# Altium project Remie_Morse.PrjPcb (part 2 of 3)
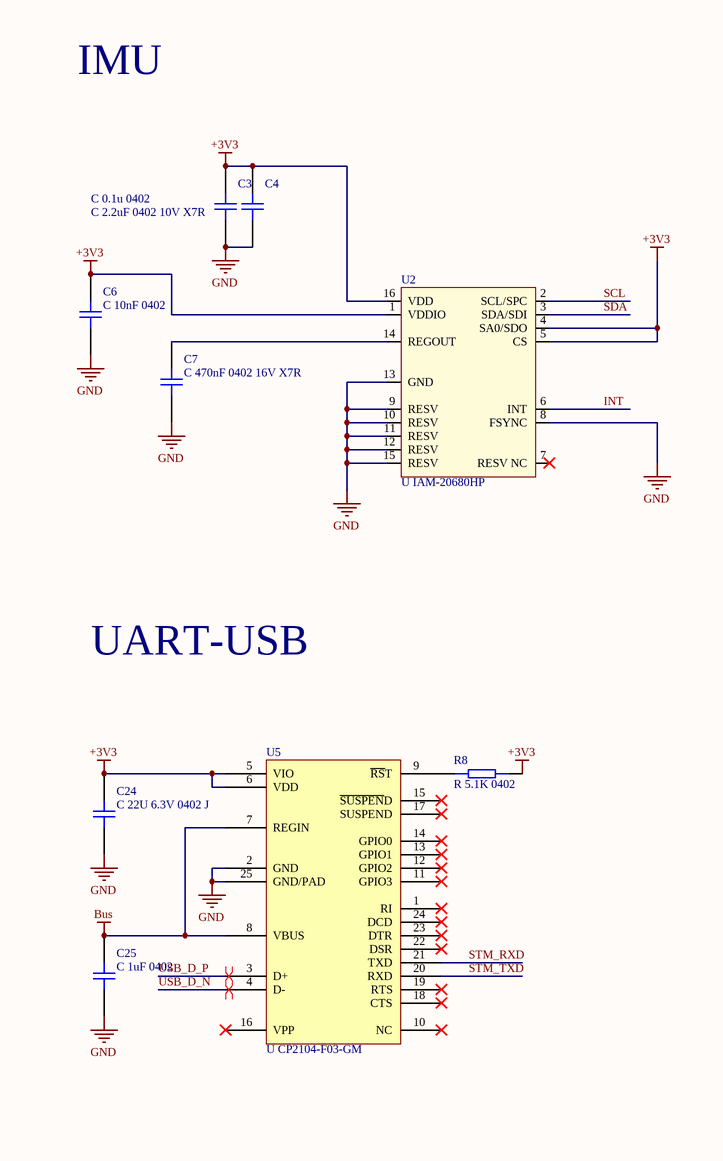
[diagram p2: Remie_Schematic.SchDoc, right]

## Sheet Remie_Schematic.SchDoc (continued)
### Library data of the parts
ANT1 = ANT AMCA31-2R450G-S1F-T3: Chip Dielectric Antenna; 1dBi; 2450MHz; T/R | Abracon AMCA31-2R450G-S1F-T3; Supplier: Mouser; Supplier Part Number: 815-CA312R450GS1FT3; Manufacturer: Abracon; Manufacturer Part Number: AMCA31-2R450G-S1F-T3; RoHS: Yes; Category: RF Antennas; Stock: 21374; Pricing: 1=0,43, 10=0,321, 50=0,321, 100=0,229, 1000=0,148, 10000=0,148 (USD); ComponentLink1URL: https://datasheet.ciiva.com/29647/amca31-2r450g-s1f-t-29647350.pdf?src-supplier=Digikey; ComponentLink1Description: https://datasheet.ciiva.com/29647/amca31-2r450g-s1f-t-29647350.pdf?src-supplier=Digikey
C1 C5 = C 1U 0805 X7R 16V: Multilayer Ceramic Capacitor, 1 uF, 16 V, ± 10%, X7R, 0805 [2012 Metric]; Manufacturer: KEMET; Manufacturer Part Number: C0805C105K4RACTU; Dissipation Factor: 5%; Material: 4241ConductorMaterial; Supplier 1: RSComponents; RoHS: Yes; Category: Ceramic Capacitors; Stock 1: 10300; Pricing 1: 25=0,06100 (USD); Mount: Surface Mount,PCB; Case/Package: 0805; Number of Pins: 2; Dielectric Material: Ceramic; Case Code (Metric): 2012; Case Code (Imperial): 0805; Contact Plating: Tin,Matte; Min Operating Temperature: -55°C; Max Operating Temperature: 125°C; Capacitance: 1uF; Tolerance: 10%; Packaging: Tape and Reel; Voltage Rating (DC): 16V; Dielectric: X7R; Package Quantity: 1; Voltage Rating: 16V; Termination: SMD/SMT; Voltage: 16V; Series: C; Construction: Flat; Length: 2mm; Width: 0.049inch; Height: 0.9mm; Thickness: 0.039inch; Lead Pitch: 0.75mm; Depth: 1.25mm; Radiation Hardening: No; REACH SVHC: No SVHC; RoHS Compliant: Yes; ComponentLink1URL: https://datasheet.ciiva.com/6074/1722731-6074364.pdf?src-supplier=Farnell; ComponentLink1Description: https://datasheet.ciiva.com/6074/1722731-6074364.pdf?src-supplier=Farnell; ComponentLink2URL: https://datasheet.ciiva.com/28692/1851736-28692942.pdf?src-supplier=Element14; ComponentLink2Description: https://datasheet.ciiva.com/28692/1851736-28692942.pdf?src-supplier=Element14; ComponentLink3URL: https://datasheet.ciiva.com/14585/70095383-14585511.pdf?src-supplier=Allied+Electronics; ComponentLink3Description: https://datasheet.ciiva.com/14585/70095383-14585511.pdf?src-supplier=Allied+Electronics; ComponentLink4URL: https://datasheet.ciiva.com/14603/70095383-14603388.pdf?src-supplier=Allied+Electronics; ComponentLink4Description: https://datasheet.ciiva.com/14603/70095383-14603388.pdf?src-supplier=Allied+Electronics; ComponentLink5URL: https://datasheet.ciiva.com/45846/docfinderpartnumberc0402c102k5ractu-45846934.pdf?src-supplier=Onlinecomponents.com; ComponentLink5Description: https://datasheet.ciiva.com/45846/docfinderpartnumberc0402c102k5ractu-45846934.pdf?src-supplier=Onlinecomponents.com; ComponentLink6URL: https://datasheet.ciiva.com/18193/getdatasheetpartid-331279-18193467.pdf?src-supplier=Verical; ComponentLink6Description: https://datasheet.ciiva.com/18193/getdatasheetpartid-331279-18193467.pdf?src-supplier=Verical; ComponentLink7URL: https://datasheet.ciiva.com/39122/docfinderpartnumberc0402c102k5ractu-39122926.pdf?src-supplier=Onlinecomponents.com; ComponentLink7Description: https://datasheet.ciiva.com/39122/docfinderpartnumberc0402c102k5ractu-39122926.pdf?src-supplier=Onlinecomponents.com; Supplier Part Number 1: 4515770; Supplier: Mouser; Supplier Part Number: 80-C0805C105K4R; Stock: 415305; Pricing: 1=0,1, 10=0,07, 50=0,07, 100=0,041, 1000=0,026, 10000=0,019 (USD); Mounting Technology: Surface Mount,PCB; Pins: 2; Value: 1uF; Voltage Rating (AC): 16V; Reach SVHC Compliant: No; Lead Free: 5697LeadFree
C2 = C 10uF 1206 6.3V X7R: 1206 6.3 V 10 uF ±10% Tolerance X7R SMT Multilayer Ceramic Capacitor; Manufacturer: Kyocera AVX; Capacitance: 10uF; Voltage Rating: 6.3V; Supplier 1: Mouser; Manufacturer Part Number: 12066C106KAT2A; RoHS: Yes; Category: Ceramic Capacitors; Stock 1: 4630; Pricing 1: 1=0,45000, 10=0,42000, 50=0,42000, 100=0,42000, 1000=0,42000, 10000=0,35600 (USD); Mount: Surface Mount; Case/Package: 1206; Number of Pins: 2; Case Code (Metric): 3216; Case Code (Imperial): 1206; Min Operating Temperature: -55°C; Max Operating Temperature: 125°C; Tolerance: 10%; Packaging: Tape and Reel; Dielectric: X7R; Package Quantity: 2500; Voltage Rating (DC): 6.3V; Termination: SMD/SMT; Length: 3.2mm; Width: 0.063inch; Height: 1.78mm; Thickness: 0.037inch; Depth: 1.6mm; Radiation Hardening: No; Lead Free: Lead Free; ComponentLink1URL: https://datasheet.ciiva.com/6265/cx7r-6265898.pdf?src-supplier=Digi-Key; ComponentLink1Description: https://datasheet.ciiva.com/6265/cx7r-6265898.pdf?src-supplier=Digi-Key; ComponentLink2URL: https://datasheet.ciiva.com/5427/cx7r-218113-5427819.pdf?src-supplier=Mouser; ComponentLink2Description: https://datasheet.ciiva.com/5427/cx7r-218113-5427819.pdf?src-supplier=Mouser; Supplier Part Number 1: 581-12066C106KAT2A; Supplier: Digikey; Supplier Part Number: 478-KGM31HR70J106KUCT-ND; Stock: 43567; Pricing: 1=1,1, 10=0,822, 50=0,7498, 100=0,6143, 500=0,49028, 1000=0,4326 (USD); ComponentLink3URL: https://datasheet.ciiva.com/6265/cx7r-6265898.pdf?src-supplier=Digikey; ComponentLink3Description: https://datasheet.ciiva.com/6265/cx7r-6265898.pdf?src-supplier=Digikey
C3 C15-C18 = C 0.1u 0402: Multilayer Ceramic Capacitor, 0.1 uF, 50 V, ± 10%, X7R, 0402 [1005 Metric]; Manufacturer: Samsung; Manufacturer Part Number: CL05B104KB54PNC; Material: 4241ConductorMaterial; Voltage Rating: 50V; Value: 100nF; Supplier 1: Digi-Key; RoHS: Yes; Category: Ceramic Capacitors; Stock 1: 3863336; Pricing 1: 1=0,10000, 10=0,04600, 50=0,02500, 100=0,02040, 500=0,01460, 1000=0,01147, 2500=0,01043, 5000=0,00959 (USD); RoHS Compliant: Yes; Supplier Part Number 1: 1276-CL05B104KB54PNCCT-ND; JLCPCB: C307331; Supplier: Digikey; Supplier Part Number: 1276-CL05B104KB54PNCCT-ND; Stock: 765476; Pricing: 1=0,1, 10=0,044, 50=0,025, 100=0,0194, 500=0,0146, 1000=0,01147, 2500=0,01043, 5000=0,00959 (USD); Case/Package: 343Case; Min Operating Temperature: -55°C; Max Operating Temperature: 125°C; Tolerance: 10%; Height: 550um; ComponentLink1URL: https://datasheet.octopart.com/CL05B104KB54PNC-Samsung-datasheet-8326407.pdf?src-supplier=TME; ComponentLink1Description: https://datasheet.octopart.com/CL05B104KB54PNC-Samsung-datasheet-8326407.pdf?src-supplier=TME
C4 = C 2.2uF 0402 10V X7R: Multilayer Ceramic Capacitor, 2.2 uF, 10 V, ± 10%, X7R, 0402 [1005 Metric] CC0402KRX5R7BB225; Manufacturer: Yageo; Material: 4241ConductorMaterial; Voltage Rating: 16V; Dielectric: X5R; Temperature Coefficient: 30ppm/°C; Supplier: Mouser; Supplier Part Number: 603-CC402KRX5R7BB225; Manufacturer Part Number: CC0402KRX5R7BB225; RoHS: Yes; Category: Ceramic Capacitors; Stock: 83882; Pricing: 1=0,17, 10=0,067, 50=0,067, 100=0,039, 1000=0,03, 10000=0,023 (USD); Mounting Technology: Surface Mount; Case/Package: 0402; Case Code (Metric): 1005; Case Code (Imperial): 0402; Weight: 2.3E-05oz; Min Operating Temperature: -55°C; Max Operating Temperature: 85°C; Packaging: Tape and Reel; Value: 2.2uF; Tolerance: 10%; Package Quantity: 5000; Series: CC; Termination: SMD/SMT; Voltage Rating (DC): 16V; Length: 1mm; Width: 0.5mm; Height: 0.5mm; RoHS Compliant: Yes; Lead Free: Lead Free; Halogen Free: Halogen Free; ComponentLink1URL: http://www.mouser.com/ds/2/447/Yageo_UPY-GP_NP0_16V-to-50V_9-358835.pdf?src-supplier=Mouser; ComponentLink1Description: http://www.mouser.com/ds/2/447/Yageo_UPY-GP_NP0_16V-to-50V_9-358835.pdf?src-supplier=Mouser; ComponentLink2URL: http://www.yageo.com/documents/recent/UPY-GPHC_X5R_4V-to-50V_25.pdf?src-supplier=Digikey; ComponentLink2Description: http://www.yageo.com/documents/recent/UPY-GPHC_X5R_4V-to-50V_25.pdf?src-supplier=Digikey; ComponentLink3URL: https://www.yageo.com/upload/media/product/productsearch/datasheet/mlcc/UPY-GPHC_X5R_4V-to-50V_25.pdf?src-supplier=Digikey; ComponentLink3Description: https://www.yageo.com/upload/media/product/productsearch/datasheet/mlcc/UPY-GPHC_X5R_4V-to-50V_25.pdf?src-supplier=Digikey; ComponentLink4URL: https://datasheet.octopart.com/CC0402KRX5R7BB225-Yageo-datasheet-158238148.pdf?src-supplier=Farnell; ComponentLink4Description: https://datasheet.octopart.com/CC0402KRX5R7BB225-Yageo-datasheet-158238148.pdf?src-supplier=Farnell; ComponentLink5URL: https://datasheet.octopart.com/CC0402KRX5R7BB225-Yageo-datasheet-158238148.pdf?src-supplier=Newark; ComponentLink5Description: https://datasheet.octopart.com/CC0402KRX5R7BB225-Yageo-datasheet-158238148.pdf?src-supplier=Newark; ComponentLink6URL: https://datasheet.octopart.com/CC0402KRX5R7BB225-Yageo-datasheet-137700082.pdf?src-supplier=Future+Electronics; ComponentLink6Description: https://datasheet.octopart.com/CC0402KRX5R7BB225-Yageo-datasheet-137700082.pdf?src-supplier=Future+Electronics
C6 C20 = C 10nF 0402: Multilayer Ceramic Capacitor, 0.01 uF, 50 V, ± 10%, X7R, 0402 [1005 Metric]; Manufacturer: Samsung; Manufacturer Part Number: CL05B103KB5NNNC; Voltage Rating: 50V; Supplier 1: Arrow Electronics; RoHS: Yes; Category: Ceramic Capacitors; Stock 1: 6530000; Pricing 1: 10000=0,00290, 20000=0,00230, 50000=0,00210, 100000=0,00190 (USD); Mount: Surface Mount; Case/Package: 0402; Case Code (Metric): 1005; Case Code (Imperial): 0402; Material: Ceramic; Contact Plating: Tin; Min Operating Temperature: -55°C; Max Operating Temperature: 125°C; Tolerance: 10%; Packaging: Tape and Reel; Capacitance: 10nF; Package Quantity: 1; Dielectric: X7R; Voltage: 50V; Voltage Rating (DC): 50V; Series: CL; Construction: Flat; Length: 1mm; Width: 0.02inch; Height: 0.5mm; Thickness: 0.022inch; Depth: 0.5mm; Radiation Hardening: No; Lead Free: Lead Free; RoHS Compliant: Yes; ComponentLink1URL: https://datasheet.ciiva.com/15195/getdatasheetpartid-359682-15195636.pdf?src-supplier=Verical; ComponentLink1Description: https://datasheet.ciiva.com/15195/getdatasheetpartid-359682-15195636.pdf?src-supplier=Verical; ComponentLink2URL: https://datasheet.ciiva.com/29198/458761-da-01-en-vs-kondensator-0402-29198432.pdf?src-supplier=Conrad; ComponentLink2Description: https://datasheet.ciiva.com/29198/458761-da-01-en-vs-kondensator-0402-29198432.pdf?src-supplier=Conrad; ComponentLink3URL: https://datasheet.ciiva.com/26309/mlcc-catalogdownload2013-eng-26309005.pdf?src-supplier=Distrelec; ComponentLink3Description: https://datasheet.ciiva.com/26309/mlcc-catalogdownload2013-eng-26309005.pdf?src-supplier=Distrelec; Supplier 2: Digi-Key; Stock 2: 14692768; Pricing 2: 1=0,10000, 10=0,01500, 50=0,00820, 100=0,00670, 500=0,00478, 1000=0,00375, 2500=0,00341, 5000=0,00314 (USD); Supplier 3: Mouser; Stock 3: 2909879; Pricing 3: 1=0,10000, 10=0,00900, 50=0,00900, 100=0,00700, 500=0,00600, 1000=0,00500, 2500=0,00400, 10000=0,00300, 20000=0,00200 (USD); Supplier Part Number 1: CL05B103KB5NNNC; Supplier Part Number 2: 1276-1028-1-ND; Supplier Part Number 3: 187-CL05B103KB5NNNC; JLCPCB: C15195; Supplier: Mouser; Supplier Part Number: 187-CL05B103KB5NNNC; Stock: 525397; Pricing: 1=0,1, 10=0,007, 50=0,007, 100=0,005, 1000=0,003, 10000=0,002 (USD); Mounting Technology: Surface Mount; Value: 10nF
C7 = C 470nF 0402 16V X7R: Multilayer Ceramic Capacitor, 0.47 uF, 16 V, ± 10%, X7R, 0402 [1005 Metric] CC0402KRX7R5BB474; Manufacturer: Yageo; Material: 4241ConductorMaterial; Voltage Rating (DC): 6.3V; Dielectric: 1511DielectricType; Temperature Coefficient: 30ppm/°C; Supplier: Digikey; Supplier Part Number: 13-CC0402KRX7R5BB474CT-ND; Manufacturer Part Number: CC0402KRX7R5BB474; Category: Ceramic Capacitors; Stock: 60692; Pricing: 1=0,27, 10=0,178, 50=0,1122, 100=0,0897, 500=0,0648, 1000=0,05733, 2500=0,05484, 5000=0,04985 (USD); Case/Package: 343Case; Min Operating Temperature: -55°C; Max Operating Temperature: 125°C; Value: 470nF; Voltage Rating: 6.3V; Height: 550um; RoHS Compliant: Yes; Lead Free: 5697LeadFree; Halogen Free: 5694HalogenFree; ComponentLink1URL: https://datasheet.octopart.com/CC0402KRX7R5BB474-Yageo-datasheet-78855684.pdf?src-supplier=Upverter; ComponentLink1Description: https://datasheet.octopart.com/CC0402KRX7R5BB474-Yageo-datasheet-78855684.pdf?src-supplier=Upverter; ComponentLink2URL: https://datasheet.octopart.com/CC0402KRX7R5BB474-Yageo-datasheet-166511530.pdf?src-supplier=Future+Electronics; ComponentLink2Description: https://datasheet.octopart.com/CC0402KRX7R5BB474-Yageo-datasheet-166511530.pdf?src-supplier=Future+Electronics; ComponentLink3URL: https://datasheet.octopart.com/CC0402KRX7R5BB474-Yageo-datasheet-165992755.pdf?src-supplier=Future+Electronics; ComponentLink3Description: https://datasheet.octopart.com/CC0402KRX7R5BB474-Yageo-datasheet-165992755.pdf?src-supplier=Future+Electronics; ComponentLink4URL: https://datasheet.octopart.com/CC0402KRX7R5BB474-Yageo-datasheet-10883670.pdf; ComponentLink4Description: https://datasheet.octopart.com/CC0402KRX7R5BB474-Yageo-datasheet-10883670.pdf
C8 C9 = C 22uF 1210 X7R 6.3V: Cap Ceramic 22uF 6.3V X7R 10% SMD 1210 125C Plastic T/R; Manufacturer: KEMET; Supplier 1: Mouser; Manufacturer Part Number: C1210C226K9RACTU; RoHS: Yes; Category: Ceramic Capacitors; Stock 1: 951; Pricing 1: 1=0,88000, 10=0,55700, 50=0,55700, 100=0,48000, 1000=0,36300, 10000=0,36300 (USD); Mount: Surface Mount; Case/Package: 1210; Case Code (Imperial): 1210; Case Code (Metric): 3225; Dielectric Material: Ceramic; Min Operating Temperature: -55°C; Max Operating Temperature: 125°C; Tolerance: 10%; Capacitance: 22uF; Voltage Rating (DC): 6.3V; Packaging: Tape and Reel; Package Quantity: 1000; Dielectric: X7R; Termination: SMD/SMT; Voltage Rating: 6.3V; Series: C; Construction: Flat; Length: 3.2mm; Width: 2.5mm; Height: 2.5mm; Thickness: 0.11inch; Depth: 2.5mm; Radiation Hardening: No; RoHS Compliant: Yes; REACH SVHC: No SVHC; ComponentLink1URL: https://datasheet.ciiva.com/5413/kem-c1002-x7r-smd-357932-5413704.pdf?src-supplier=Mouser; ComponentLink1Description: https://datasheet.ciiva.com/5413/kem-c1002-x7r-smd-357932-5413704.pdf?src-supplier=Mouser; ComponentLink2URL: https://datasheet.ciiva.com/7807/kem-c1002-x7r-smd-7807532.pdf?src-supplier=Element14; ComponentLink2Description: https://datasheet.ciiva.com/7807/kem-c1002-x7r-smd-7807532.pdf?src-supplier=Element14; ComponentLink3URL: https://datasheet.ciiva.com/28608/1918693-28608766.pdf?src-supplier=Element14; ComponentLink3Description: https://datasheet.ciiva.com/28608/1918693-28608766.pdf?src-supplier=Element14; Supplier Part Number 1: 80-C1210C226K9R
C10 = C 0.8 pF 0402 50V C0G: Multilayer Ceramic Capacitor, 0.8 pF, 50 V, ± 0.1pF, C0G (NP0), 0402 [1005 Metric] GRM1555C1HR80BA01D; Manufacturer: Murata; Value: 0.8pF; Supplier: Mouser; Supplier Part Number: 81-GRM1555C1HR80BA1D; Manufacturer Part Number: GRM1555C1HR80BA01D; RoHS: Yes; Category: Ceramic Capacitors; Stock: 38144; Pricing: 1=0,1, 10=0,04, 50=0,04, 100=0,023, 1000=0,018, 10000=0,015 (USD); Mounting Technology: Surface Mount; Case/Package: 0402; Case Code (Metric): 1005; Case Code (Imperial): 0402; Material: Ceramic; Min Operating Temperature: -55°C; Max Operating Temperature: 125°C; Package Quantity: 1; Voltage Rating: 50V; Packaging: Tape and Reel; Voltage Rating (DC): 50V; Dielectric: C0G; Termination: SMD/SMT; Voltage: 50V; Series: GRM; Construction: Flat; Length: 1mm; Width: 0.5mm; Height: 0.5mm; Thickness: 0.022inch; Depth: 0.5mm; Radiation Hardening: No; Lead Free: Lead Free; RoHS Compliant: Yes; ComponentLink1URL: https://datasheet.ciiva.com/6263/grm1555c1hr75ba01-01-6263972.pdf?src-supplier=Digikey; ComponentLink1Description: https://datasheet.ciiva.com/6263/grm1555c1hr75ba01-01-6263972.pdf?src-supplier=Digikey; ComponentLink2URL: https://datasheet.ciiva.com/5436/product-5436190.pdf?src-supplier=Mouser; ComponentLink2Description: https://datasheet.ciiva.com/5436/product-5436190.pdf?src-supplier=Mouser; ComponentLink3URL: https://datasheet.ciiva.com/11616/product-11616827.pdf?src-supplier=Avnet; ComponentLink3Description: https://datasheet.ciiva.com/11616/product-11616827.pdf?src-supplier=Avnet; ComponentLink4URL: https://datasheet.ciiva.com/6263/partnumbering-e-01-6263975.pdf?src-supplier=Digikey; ComponentLink4Description: https://datasheet.ciiva.com/6263/partnumbering-e-01-6263975.pdf?src-supplier=Digikey; ComponentLink5URL: https://datasheet.ciiva.com/6263/partnumbering-e-01-6263977.pdf?src-supplier=Digikey; ComponentLink5Description: https://datasheet.ciiva.com/6263/partnumbering-e-01-6263977.pdf?src-supplier=Digikey
C11 = C 0.3 pF 0402 50V C0G: Cap Ceramic 0.3pF 50V C0G 0.05pF Pad SMD 0402 125°C T/R; Manufacturer: Murata; Manufacturer Part Number: GRM1555C1HR30WA01D; Supplier: Mouser; Supplier Part Number: 81-GRM1555C1HR30WA1D; RoHS: Yes; Category: Ceramic Capacitors; Stock: 16234; Pricing: 1=0,17, 10=0,065, 50=0,065, 100=0,038, 1000=0,033, 10000=0,028 (USD); ComponentLink1URL: https://datasheet.ciiva.com/6264/grm1555c1hr30ba01-01-6264100.pdf?src-supplier=Digikey; ComponentLink1Description: https://datasheet.ciiva.com/6264/grm1555c1hr30ba01-01-6264100.pdf?src-supplier=Digikey; ComponentLink2URL: https://datasheet.ciiva.com/11617/product-11617602.pdf?src-supplier=Avnet; ComponentLink2Description: https://datasheet.ciiva.com/11617/product-11617602.pdf?src-supplier=Avnet; ComponentLink3URL: https://datasheet.ciiva.com/6264/partnumbering-e-01-6264101.pdf?src-supplier=Digikey; ComponentLink3Description: https://datasheet.ciiva.com/6264/partnumbering-e-01-6264101.pdf?src-supplier=Digikey; ComponentLink4URL: https://datasheet.ciiva.com/6264/partnumbering-e-01-6264102.pdf?src-supplier=Digikey; ComponentLink4Description: https://datasheet.ciiva.com/6264/partnumbering-e-01-6264102.pdf?src-supplier=Digikey
C12 C19 C25 = C 1uF 0402: Multilayer Ceramic Capacitor, 1 uF, 10 V, ± 10%, X5R, 0402 [1005 Metric]; Manufacturer: Samsung; Manufacturer Part Number: CL05A105KP5NNNC; Voltage Rating: 10V; Supplier 1: Arrow Electronics; RoHS: Yes; Category: Ceramic Capacitors; Stock 1: 131; Pricing 1: 1=0,06300, 10=0,04210, 25=0,03040, 100=0,01620, 500=0,01020 (USD); Mount: Surface Mount; Case/Package: 0402; Case Code (Metric): 1005; Case Code (Imperial): 0402; Contact Plating: Tin; Material: Ceramic; Min Operating Temperature: -55°C; Max Operating Temperature: 85°C; Capacitance: 1uF; Tolerance: 10%; Package Quantity: 1; Packaging: Tape and Reel; Dielectric: X5R; Series: CL; Length: 1mm; Width: 0.02inch; Height: 0.5mm; Thickness: 0.022inch; Depth: 0.5mm; Radiation Hardening: No; RoHS Compliant: Yes; ComponentLink1URL: http://www.farnell.com/datasheets/2710650.pdf?src-supplier=Farnell; ComponentLink1Description: http://www.farnell.com/datasheets/2710650.pdf?src-supplier=Farnell; ComponentLink2URL: http://www.samsungsem.com/kr/support/product-search/mlcc/CL05A105KP5NNNC.jsp?src-supplier=Digi-Key; ComponentLink2Description: http://www.samsungsem.com/kr/support/product-search/mlcc/CL05A105KP5NNNC.jsp?src-supplier=Digi-Key; ComponentLink3URL: http://www.farnell.com/datasheets/2710650.pdf?src-supplier=Element14; ComponentLink3Description: http://www.farnell.com/datasheets/2710650.pdf?src-supplier=Element14; Supplier 2: Digi-Key; Stock 2: 6411089; Pricing 2: 1=0,10000, 10=0,03600, 50=0,01960, 100=0,01610, 500=0,01148, 1000=0,00903, 2500=0,00821, 5000=0,00755 (USD); Supplier 3: Mouser; Stock 3: 1468368; Pricing 3: 1=0,10000, 10=0,02200, 50=0,02200, 100=0,01700, 500=0,01300, 1000=0,01000, 2500=0,00900, 10000=0,00600, 50000=0,00500 (USD); Supplier Part Number 1: CL05A105KP5NNNC; Supplier Part Number 2: 1276-1076-1-ND; Supplier Part Number 3: 187-CL05A105KP5NNNC; JLCPCB: C14445; Supplier: Mouser; Supplier Part Number: 187-CL05A105KP5NNNC; Stock: 1490982; Pricing: 1=0,1, 10=0,02, 50=0,02, 100=0,012, 1000=0,009, 10000=0,006 (USD); Voltage Rating (DC): 10V; ComponentLink4URL: https://datasheet.ciiva.com/15195/getdatasheetpartid-358390-15195630.pdf?src-supplier=Verical; ComponentLink4Description: https://datasheet.ciiva.com/15195/getdatasheetpartid-358390-15195630.pdf?src-supplier=Verical; ComponentLink5URL: https://datasheet.ciiva.com/29198/459159-da-01-en-vs-kondensator-0402-29198341.pdf?src-supplier=Conrad; ComponentLink5Description: https://datasheet.ciiva.com/29198/459159-da-01-en-vs-kondensator-0402-29198341.pdf?src-supplier=Conrad
C13 C14 C21 C23 = C 4.7uF 0402 16V: Multilayer Ceramic Capacitor, 4.7 uF, 16 V, ± 20%, X5R, 0402 [1005 Metric] CL05A475MO5NUNC; Manufacturer: Samsung; Material: 4241ConductorMaterial; Supplier: Avnet; Supplier Part Number: 82AC9197; Manufacturer Part Number: CL05A475MO5NUNC; RoHS: Yes; Category: Ceramic Capacitors; Stock: 26909; Pricing: 1=0,458, 25=0,305, 100=0,182, 250=0,163, 500=0,144 (USD); Mounting Technology: Surface Mount; Case/Package: 0402; Case Code (Metric): 1005; Case Code (Imperial): 0402; Min Operating Temperature: -55°C; Max Operating Temperature: 85°C; Packaging: Cut Tape; Value: 4.7uF; Voltage Rating: 16V; Tolerance: 20%; Series: CL; Voltage Rating (DC): 16V; Length: 0.039inch; Width: 0.02inch; Height: 550um; Thickness: 0.022inch; RoHS Compliant: Yes
C22 = C 0.1u 0402 J: Cap Ceramic 0.1uF 50V X7R 10% Pad SMD 0402 125C Low ESR Automotive CL05B104KB54PNC; Manufacturer: Samsung; Supplier 1: Digi-Key; Manufacturer Part Number: CL05B104KB54PNC; RoHS: Yes; Category: Ceramic Capacitors; Stock 1: 3863336; Pricing 1: 1=0,10000, 10=0,04600, 50=0,02500, 100=0,02040, 500=0,01460, 1000=0,01147, 2500=0,01043, 5000=0,00959 (USD); RoHS Compliant: Yes; Supplier Part Number 1: 1276-CL05B104KB54PNCCT-ND; JLCPCB: C307331
C24 = C 22U 6.3V 0402 J: CAP CER 22F 6.3V X5R 0402 CM05X5R226M06AH080; Manufacturer: Kyocera AVX; Supplier 1: Mouser; Manufacturer Part Number: CM05X5R226M06AH080; RoHS: No; Category: Ceramic Capacitors; Stock 1: 167626; Pricing 1: 1=0,37000, 10=0,26400, 50=0,26400, 100=0,15800, 1000=0,10000, 10000=0,08400 (USD); Supplier 2: Digi-Key; Supplier Part Number 1: 346-CM05X5R226M6AH80; Supplier Part Number 2: 1253-CM05X5R226M06AH080CT-ND; JLCPCB: C919306
D1 = D BI LED WURTH 150141SV73110: WL-SBTW SMT bi-color TOP LED waterclear; Manufacturer: Wurth Electronics; Supplier: Digikey; Supplier Part Number: 732-13404-1-ND; Manufacturer Part Number: 150141SV73110; RoHS: No; Category: LEDs; Stock: 1012; Pricing: 1=0,74, 10=0,64, 50=0,562, 250=0,505, 500=0,451 (USD); RoHS Compliant: No; ComponentLink1Description: Datasheet; ComponentLink1URL: https://www.we-online.com/catalog/datasheet/150141SV73110.pdf
D2 = D Schottky 1A: ON SEMICONDUCTOR - NSR10F40NXT5G - Small Signal Schottky Diode, Single, 40 V, 1 A, 490 mV, 18 A, 150 °C; Forward Current: 1A; Max Reverse Current: 100nA; Max Surge Current: 18A; Forward Voltage: 490mV; Max Repetitive Reverse Voltage (Vrrm): 40V; Max Reverse Leakage Current: 100uA; Max Power Dissipation: 1.16W; Supplier 1: RSComponents; Manufacturer: ON Semiconductor; Manufacturer Part Number: NSR10F40NXT5G; RoHS: Yes; Category: Rectifier Diodes; Stock 1: 7125; Pricing 1: 5000=0,11800, 10000=0,11600 (GBP); Case/Package: 0502; Number of Pins: 2; Contact Plating: Tin,Matte; Min Operating Temperature: -40°C; Max Operating Temperature: 150°C; Package Quantity: 1; Packaging: Tape and Reel; Average Rectified Current: 1A; Peak Non-Repetitive Surge Current: 18A; Max Forward Surge Current (Ifsm): 18A; Element Configuration: Single; Max Reverse Voltage (DC): 40V; Series: -; Radiation Hardening: No; Lead Free: Lead Free; RoHS Compliant: Yes; REACH SVHC: No SVHC; ComponentLink1URL: https://datasheet.ciiva.com/22663/1807829-22663699.pdf?src-supplier=Element14; ComponentLink1Description: https://datasheet.ciiva.com/22663/1807829-22663699.pdf?src-supplier=Element14; ComponentLink2URL: https://datasheet.ciiva.com/4713/nsr10f40-114327-4713998.pdf?src-supplier=Mouser; ComponentLink2Description: https://datasheet.ciiva.com/4713/nsr10f40-114327-4713998.pdf?src-supplier=Mouser; ComponentLink3URL: https://datasheet.ciiva.com/915/nsr10f40-d-915834.pdf?src-supplier=Digi-Key; ComponentLink3Description: https://datasheet.ciiva.com/915/nsr10f40-d-915834.pdf?src-supplier=Digi-Key; ComponentLink4URL: https://datasheet.ciiva.com/915/nsr10f40-d-915835.pdf?src-supplier=Digi-Key; ComponentLink4Description: https://datasheet.ciiva.com/915/nsr10f40-d-915835.pdf?src-supplier=Digi-Key; ComponentLink5URL: https://datasheet.ciiva.com/915/nsr10f40-d-915836.pdf?src-supplier=Digi-Key; ComponentLink5Description: https://datasheet.ciiva.com/915/nsr10f40-d-915836.pdf?src-supplier=Digi-Key; Supplier Part Number 1: 1867525
D3 = D FDN306P: P-Channel PowerTrench® MOSFET, 1.8V Specified, -12V, -2.6A, 40mΩ; Manufacturer: ON Semiconductor / Fairchild; Input Capacitance: 1.138nF; Drain to Source Voltage (Vdss): 12V; Continuous Drain Current (ID): 2.6A; Drain to Source Resistance: 40mR; Gate to Source Voltage (Vgs): 8V; Rise Time: 10ns; Max Power Dissipation: 500mW; Turn-Off Delay Time: 38ns; Turn-On Delay Time: 11ns; Nominal Vgs: -600mV; Number of Elements: 1; Current: 26A; Supplier: Mouser; Supplier Part Number: 512-FDN306P; Manufacturer Part Number: FDN306P; RoHS: Yes; Category: MOSFETs; Stock: 78968; Pricing: 1=0,43, 10=0,371, 50=0,371, 100=0,258, 1000=0,164, 10000=0,128 (USD); Mounting Technology: Surface Mount; Case/Package: TO-236-3; Pins: 3; Min Operating Temperature: -55°C; Max Operating Temperature: 150°C; Packaging: Tape and Reel; Package Quantity: 1; Rds On Max: 40mR; Polarity: P-CHANNEL; Series: PowerTrench®; Fall Time: 10ns; Power Dissipation: 500mW; Threshold Voltage: -600mV; Drain to Source Breakdown Voltage: -12V; Voltage Rating (DC): -12V; Current Rating: -2.6A; Drain-source On Resistance-Max: 40MR; Dual Supply Voltage: -12V; Termination: SMD/SMT; Voltage: 12V; Length: 2.92mm; Width: 1.4mm; Height: 0.94mm; Radiation Hardening: No; Reach SVHC Compliant: No; Lead Free: Lead Free; RoHS Compliant: Yes; ComponentLink1URL: https://datasheet.ciiva.com/14170/fdn306p-eng-tds-14170925.pdf?src-supplier=Distrelec; ComponentLink1Description: https://datasheet.ciiva.com/14170/fdn306p-eng-tds-14170925.pdf?src-supplier=Distrelec; ComponentLink2URL: https://datasheet.ciiva.com/4439/fdn306p-50876-4439911.pdf?src-supplier=Mouser; ComponentLink2Description: https://datasheet.ciiva.com/4439/fdn306p-50876-4439911.pdf?src-supplier=Mouser; ComponentLink3URL: https://datasheet.ciiva.com/27050/889760-27050636.pdf?src-supplier=Jameco; ComponentLink3Description: https://datasheet.ciiva.com/27050/889760-27050636.pdf?src-supplier=Jameco; ComponentLink4URL: https://datasheet.ciiva.com/22700/264983-22700885.pdf?src-supplier=Element14; ComponentLink4Description: https://datasheet.ciiva.com/22700/264983-22700885.pdf?src-supplier=Element14; ComponentLink5URL: https://datasheet.ciiva.com/22655/fdn306p-22655327.pdf?src-supplier=Element14; ComponentLink5Description: https://datasheet.ciiva.com/22655/fdn306p-22655327.pdf?src-supplier=Element14; ComponentLink6URL: https://datasheet.ciiva.com/11175/fdn306p-11175160.pdf?src-supplier=Avnet; ComponentLink6Description: https://datasheet.ciiva.com/11175/fdn306p-11175160.pdf?src-supplier=Avnet; ComponentLink7URL: https://datasheet.ciiva.com/17275/fdn306p-17275114.pdf?src-supplier=Future+Electronics; ComponentLink7Description: https://datasheet.ciiva.com/17275/fdn306p-17275114.pdf?src-supplier=Future+Electronics
D4 = D USBLC6-2SC6: USBLC6 Series 2 Line 6 V Uni / Bi-Directional ESD Protection - SOT-23-6; Manufacturer: STMicroelectronics; Direction: Unidirectional,Bidirectional; Value: 3.5pF; Operating Supply Voltage: 1.1V; Number of Channels: 2; Breakdown Voltage: 6V; Clamping Voltage: 17V; Reverse Standoff Voltage: 5.25V; Power Line Protection: Yes; Test Current: 1mA; Max Reverse Leakage Current: 150nA; Peak Pulse Current: 5A; Data Rate: 480Mbps; Number of Elements: 1; Working Voltage: 5V; Supplier: Mouser; Supplier Part Number: 511-USBLC6-2SC6; Manufacturer Part Number: USBLC6-2SC6; RoHS: Yes; Category: TVS Diodes; Stock: 126404; Pricing: 1=0,58, 10=0,496, 50=0,496, 100=0,345, 1000=0,219, 10000=0,164 (USD); Mounting Technology: Surface Mount; Case/Package: SOT-23; Pins: 6; Min Operating Temperature: -40°C; Max Operating Temperature: 125°C; Packaging: Tape and Reel; Package Quantity: 3000; Termination: SMD/SMT; Number of Bidirectional Channels: 2; Min Breakdown Voltage: 6V; ESD Protection: Yes; Leakage Current: 150nA; Series: USB; Reverse Breakdown Voltage: 6V; Polarity: Unidirectional,Bidirectional; Max Breakdown Voltage: 6V; Clamping Voltage-Max: 17V; Length: 3.05mm; Width: 1.75mm; Height: 1.3mm; Depth: 1.75mm; Radiation Hardening: No; Reach SVHC Compliant: No; Lead Free: Lead Free; RoHS Compliant: Yes; ComponentLink1URL: https://datasheet.ciiva.com/1268/1690354-1268384.pdf?src-supplier=Element14; ComponentLink1Description: https://datasheet.ciiva.com/1268/1690354-1268384.pdf?src-supplier=Element14; ComponentLink2URL: https://datasheet.ciiva.com/4508/cd00050750-113117-4508433.pdf?src-supplier=Mouser; ComponentLink2Description: https://datasheet.ciiva.com/4508/cd00050750-113117-4508433.pdf?src-supplier=Mouser; ComponentLink3URL: https://datasheet.ciiva.com/15143/getdatasheetpartid-148465-15143789.pdf?src-supplier=Verical; ComponentLink3Description: https://datasheet.ciiva.com/15143/getdatasheetpartid-148465-15143789.pdf?src-supplier=Verical; ComponentLink4URL: https://datasheet.ciiva.com/16200/cd00050750-16200026.pdf?src-supplier=Future+Electronics; ComponentLink4Description: https://datasheet.ciiva.com/16200/cd00050750-16200026.pdf?src-supplier=Future+Electronics; ComponentLink5URL: https://datasheet.ciiva.com/41444/001184109-da-01-en-ic-esd-protecti-usblc6-2sc6-sot-23-6-stm-41444156.pdf?src-supplier=Conrad; ComponentLink5Description: https://datasheet.ciiva.com/41444/001184109-da-01-en-ic-esd-protecti-usblc6-2sc6-sot-23-6-stm-41444156.pdf?src-supplier=Conrad
FLT1 = FLT DLF162500LT-5028A1: FILTER, LOW PASS, 2.4GHz to 2.5GHz; Filter Type: Low Pass; Pass Band Frequency: 2.; Manufacturer: TDK; Supplier: Farnell; Supplier Part Number: 3650703; Manufacturer Part Number: DLF162500LT-5028A1; RoHS: Yes; Stock: 1078; Pricing: 10=0,372, 100=0,299, 500=0,243, 1000=0,215, 2000=0,195, 4000=0,174, 20000=0,171, 40000=0,167 (EUR); ComponentLink1URL: https://datasheet.ciiva.com/24123/dlf162500lt-5028a1-279920-24123794.pdf?src-supplier=Mouser; ComponentLink1Description: https://datasheet.ciiva.com/24123/dlf162500lt-5028a1-279920-24123794.pdf?src-supplier=Mouser; ComponentLink2URL: https://datasheet.ciiva.com/23909/1751212-23909058.pdf?src-supplier=Newark; ComponentLink2Description: https://datasheet.ciiva.com/23909/1751212-23909058.pdf?src-supplier=Newark; ComponentLink3URL: https://datasheet.ciiva.com/30018/rf-lpf-dlf162500lt-5028a1-en-30018074.pdf?src-supplier=Avnet; ComponentLink3Description: https://datasheet.ciiva.com/30018/rf-lpf-dlf162500lt-5028a1-en-30018074.pdf?src-supplier=Avnet
I1 = I 33uH LPS4018-333MRC: Power inductor, shielded, 20/30% tol, SMT, RoHS, lead-free, halogen-free LPS4018-333MRC Isat 0.58A; Manufacturer: Coilcraft; Core Material: Ferrite; Tolerance: 20%; Max DC Current: 680mA; Self Resonant Frequency: 20MHz; Test Frequency: 100kHz; Supplier: Mouser; Supplier Part Number: 994-LPS4018-333MRC; Manufacturer Part Number: LPS4018-333MRC; RoHS: No; Category: Inductors; Stock: 5229; Pricing: 1=1,22, 10=1,22, 50=1,22, 100=1,22, 1000=0,663, 10000=0,663 (USD); Case/Package: SMD/SMT; Weight: 0.003527oz; Min Operating Temperature: -40°C; Max Operating Temperature: 85°C; Shielding: Shielded; Termination: SMD/SMT; Packaging: Tape and Reel; Value: 33uH; Package Quantity: 1000; Series: LPS4018; Length: 4mm; Width: 4mm; Height: 1.7mm; RoHS Compliant: No; ComponentLink1URL: http://www.mouser.com/ds/2/597/lps4018-270702.pdf?src-supplier=Mouser; ComponentLink1Description: http://www.mouser.com/ds/2/597/lps4018-270702.pdf?src-supplier=Mouser
I2 = I 2.7nH 0402: 0402 2.7nH ±0.3nH DCR=120mΩ Q=8@100MHz 800mA SRF=6GHz LQG15HS2N7S02D; Manufacturer: Murata; Core Material: Air; Q Factor: 8; Self Resonant Frequency: 6GHz; Current Rating: 300mA; Shielding: Unshielded; DC Resistance (DCR): 150mR; Test Frequency: 100MHz; Supplier: Mouser; Supplier Part Number: 81-LQG15HS2N7S02D; Manufacturer Part Number: LQG15HS2N7S02D; RoHS: Yes; Category: Fixed Inductors; Stock: 39556; Pricing: 1=0,1, 10=0,036, 50=0,036, 100=0,028, 1000=0,022, 10000=0,019 (USD); Mounting Technology: Surface Mount; Case/Package: 0402; Case Code (Metric): 1005; Case Code (Imperial): 0402; Min Operating Temperature: -55°C; Max Operating Temperature: 125°C; Packaging: Tape and Reel; Package Quantity: 1; Value: 2.7nH; Max DC Current: 300mA; Termination: SMD/SMT; DC Current: 300mA; Series: LQG15HS; Max Current Rating: 300mA; Length: 1mm; Width: 0.02inch; Height: 0.5mm; Height - Seated (Max): 0.022inch; Depth: 0.55mm; Radiation Hardening: No; Military Standard: Not; Lead Free: Lead Free; RoHS Compliant: Yes; ComponentLink1URL: https://datasheet.ciiva.com/11801/0900766b8090d685-11801391.pdf?src-supplier=Rs; ComponentLink1Description: https://datasheet.ciiva.com/11801/0900766b8090d685-11801391.pdf?src-supplier=Rs; ComponentLink2URL: https://datasheet.ciiva.com/1038/l0075s0083lqg15hs-1038152.pdf?src-supplier=Digikey; ComponentLink2Description: https://datasheet.ciiva.com/1038/l0075s0083lqg15hs-1038152.pdf?src-supplier=Digikey; ComponentLink3URL: https://datasheet.ciiva.com/1038/l0075s0083lqg15hs-1038151.pdf?src-supplier=Digikey; ComponentLink3Description: https://datasheet.ciiva.com/1038/l0075s0083lqg15hs-1038151.pdf?src-supplier=Digikey; ComponentLink4URL: https://datasheet.ciiva.com/1038/l0075s0083lqg15hs-1038153.pdf?src-supplier=Digikey; ComponentLink4Description: https://datasheet.ciiva.com/1038/l0075s0083lqg15hs-1038153.pdf?src-supplier=Digikey; ComponentLink5URL: https://datasheet.ciiva.com/8510/l0075s0083lqg15hs-8510853.pdf?src-supplier=Avnet; ComponentLink5Description: https://datasheet.ciiva.com/8510/l0075s0083lqg15hs-8510853.pdf?src-supplier=Avnet
I3 = I 8.3nH 2% RF 0402: Ind Chip Wirewound 8.3nH 0.2nH 0402 Paper T/R LQW15AN8N3C1ZD; Manufacturer: Murata; Supplier: Mouser; Supplier Part Number: 81-LQW15AN8N3C1ZD; Manufacturer Part Number: LQW15AN8N3C1ZD; RoHS: Yes; Category: Fixed Inductors; Stock: 672; Pricing: 1=0,22, 10=0,179, 50=0,179, 100=0,128, 1000=0,088, 10000=0,073 (USD)
I4 I5 = I 9.7nH 5% RF 0402: Ind Chip Wirewound 9.7nH 5% 0402 Paper T/R LQW15AN9N7J0ZD; Manufacturer: Murata; Supplier: Mouser; Supplier Part Number: 81-LQW15AN9N7J0ZD; Manufacturer Part Number: LQW15AN9N7J0ZD; Category: Fixed Inductors; Stock: 7774; Pricing: 1=0,18, 10=0,148, 50=0,148, 100=0,106, 1000=0,073, 10000=0,061 (USD); ComponentLink1URL: https://datasheet.octopart.com/LQW15AN9N7J0ZD-Murata-datasheet-142542139.pdf?src-supplier=Ciiva+Crawler; ComponentLink1Description: https://datasheet.octopart.com/LQW15AN9N7J0ZD-Murata-datasheet-142542139.pdf?src-supplier=Ciiva+Crawler; ComponentLink2URL: https://datasheet.octopart.com/LQW15AN9N7J0ZD-Murata-datasheet-140717477.pdf?src-supplier=Ciiva+Crawler; ComponentLink2Description: https://datasheet.octopart.com/LQW15AN9N7J0ZD-Murata-datasheet-140717477.pdf?src-supplier=Ciiva+Crawler; ComponentLink3URL: https://datasheet.octopart.com/LQW15AN9N7J0ZD-Murata-datasheet-140716931.pdf?src-supplier=Ciiva+Crawler; ComponentLink3Description: https://datasheet.octopart.com/LQW15AN9N7J0ZD-Murata-datasheet-140716931.pdf?src-supplier=Ciiva+Crawler; ComponentLink4URL: https://datasheet.octopart.com/LQW15AN9N7J0ZD-Murata-datasheet-138758516.pdf?src-supplier=Ciiva+Crawler; ComponentLink4Description: https://datasheet.octopart.com/LQW15AN9N7J0ZD-Murata-datasheet-138758516.pdf?src-supplier=Ciiva+Crawler; ComponentLink5URL: https://datasheet.octopart.com/LQW15AN9N7J0ZD-Murata-datasheet-145451983.pdf?src-supplier=Geoflip; ComponentLink5Description: https://datasheet.octopart.com/LQW15AN9N7J0ZD-Murata-datasheet-145451983.pdf?src-supplier=Geoflip
I6 I7 = I 10 nH Murata: Inductor RF Chip Unshielded Multi-Layer 0.01uH 5% 100MHz 23Q-Factor 0.5A 0.19Ohm DCR 0402 Automotive T/R LQG15WZ10NJ02D; Core Material: Air; Value: 10nH; Current Rating: 500mA; DC Resistance (DCR): 190mR; Self Resonant Frequency: 3.3GHz; Supplier: Digi-Key; Supplier Part Number: 490-15244-1-ND; Manufacturer: Murata; Manufacturer Part Number: LQG15WZ10NJ02D; RoHS: Yes; Category: Fixed Inductors; Stock: 34631; Pricing: 1=0,12, 10=0,099, 25=0,0912, 50=0,0804, 100=0,0703, 250=0,06696, 500=0,06294, 1000=0,0482, 2500=0,04553 (USD); Mounting Technology: Surface Mount; Case/Package: 0402; Case Code (Imperial): 0402; Case Code (Metric): 1005; Min Operating Temperature: -55°C; Max Operating Temperature: 125°C; Packaging: Cut Tape; Tolerance: 5%; Shielding: Unshielded; Test Frequency: 100MHz; Series: LQG15; Ratings: AEC-Q200; RoHS Compliant: Yes; ComponentLink1URL: https://datasheet.octopart.com/LQG15WZ10NJ02D-Murata-datasheet-140317171.pdf?src-supplier=Element14; ComponentLink1Description: https://datasheet.octopart.com/LQG15WZ10NJ02D-Murata-datasheet-140317171.pdf?src-supplier=Element14; ComponentLink2URL: http://search.murata.co.jp/Ceramy/image/img/P02/JELF243B-9117.pdf?src-supplier=Digi-Key; ComponentLink2Description: http://search.murata.co.jp/Ceramy/image/img/P02/JELF243B-9117.pdf?src-supplier=Digi-Key; ComponentLink3URL: https://search.murata.co.jp/Ceramy/image/img/P02/JELF243B-9117.pdf?src-supplier=Digi-Key; ComponentLink3Description: https://search.murata.co.jp/Ceramy/image/img/P02/JELF243B-9117.pdf?src-supplier=Digi-Key; ComponentLink4URL: https://datasheet.octopart.com/LQG15WZ10NJ02D-Murata-datasheet-166148638.pdf?src-supplier=TME; ComponentLink4Description: https://datasheet.octopart.com/LQG15WZ10NJ02D-Murata-datasheet-166148638.pdf?src-supplier=TME
J1 = J MOLEX 2P SMT CONN 53261-0271: 1.25mm Pitch PicoBlade™ Header, Surface Mount, Right Angle, Lead-Free, 2 Circuits; Plating: 154ConductorMaterial; Contact Resistance: 20mR; Number of Contacts: 2; Voltage Rating: 125V; Current Rating: 1A; Insulation Resistance: 100MR; Gender: Male; Glow Wire Compliant: Non-compliant; Supplier: Mouser; Supplier Part Number: 538-53261-0271; Manufacturer: Molex; Manufacturer Part Number: 53261-0271; RoHS: Yes; Category: Headers and Wire Housings; Stock: 24818; Pricing: 1=0,48, 10=0,41, 50=0,41, 100=0,346, 1000=0,262, 10000=0,239 (USD); Mounting Technology: Surface Mount; Contact Material: Bronze,Tin; Contact Plating: Tin; Color: Beige; Housing Material: Nylon; Contact Shape: Rectangular; Contact Finish - Mating: TIN; Insulation Material: Nylon; Insulation Color: Natural; Housing Color: Natural; Min Operating Temperature: -40°C; Max Operating Temperature: 85°C; Termination: Solder; Orientation: Right Angle; Number of Rows: 1; Voltage Rating (AC): 125V; Package Quantity: 1000; Packaging: Tape and Reel; Number of Positions: 2; Working Voltage: 125V; Number of Circuits: 2; Voltage Rating (DC): 125V; Connector Type: Header; Fastening Type: Detent; Series: PicoBlade; Contact Type: Blade Pin; Pitch: 1.25mm; Lead Pitch: 1.25mm; Depth: 5.2mm; Radiation Hardening: No; Lead Free: Lead Free; Flammability Rating: UL94 V-0; RoHS Compliant: Yes; Reach SVHC Compliant: Unknown
J2 = J TAG for STM TC-2030
J3 = J USB4105-GF-A: Conn USB 2.0 Type C RCP 24 POS 0.3mm/0.5mm Solder RA SMD 24 Terminal 1 Port T/R; Manufacturer: Global Connector Technology; USB Standard: 6108USBStandard; Number of Contacts: 16NUMBER; Voltage Rating: 20V; Gender: Receptacle; Mating Cycles: 10000; Shielding: Shielded; Number of Ports: 1; Supplier: Future Electronics; Supplier Part Number: 7130014; Manufacturer Part Number: USB4105-GF-A; RoHS: No; Category: USB Connectors; Stock: 7200; Pricing: 800=0,405, 1600=0,395, 2400=0,39, 3200=0,385, 4000=0,375 (USD); Mounting Technology: Surface Mount,Through Hole,Horizontal; Contact Material: 153,157ConductorMaterial; Contact Plating: Gold; Insulation Color: Black; Min Operating Temperature: -40°C; Max Operating Temperature: 85°C; Connector Type: USB; Series: USB4105; Termination: Solder; Height: 3.46mm; Flammability Rating: UL94 V-0; ComponentLink1URL: https://gct.co/files/drawings/usb4105.pdf?src-supplier=Digikey; ComponentLink1Description: https://gct.co/files/drawings/usb4105.pdf?src-supplier=Digikey; ComponentLink2URL: https://datasheet.octopart.com/USB4105-GF-A-GCT-datasheet-166929323.pdf?src-supplier=TME; ComponentLink2Description: https://datasheet.octopart.com/USB4105-GF-A-GCT-datasheet-166929323.pdf?src-supplier=TME
R1 R2 = R 150 0402: SMD Chip Resistor, 150 Ohm, ± 1%, 62.5 mW, 0402 [1005 Metric], Thick Film, General Purpose; Manufacturer: Yageo; Manufacturer Part Number: RC0402FR-07150RL; Resistance: 150R; Power Rating: 62.5mW; Voltage Rating: 50V; Temperature Coefficient: 100ppm/°C; Max Power Dissipation: 63mW; Value: 150R; Supplier 1: Arrow Electronics; RoHS: Yes; Category: Chip SMD Resistors; Stock 1: 70000; Pricing 1: 10000=0,00140 (USD); Case/Package: 0402; Case Code (Metric): 1005; Case Code (Imperial): 0402; Min Operating Temperature: -55°C; Max Operating Temperature: 155°C; Tolerance: 1%; Packaging: Tape and Reel; Package Quantity: 1; Resistor Type: Thick Film; Number of Terminations: 2; Termination: SMD/SMT; Working Voltage: 50V; Features: Moisture Resistant; Series: RC; Resistance Tolerance: 1%; Construction: Rectangular; Technology: THICK FILM; Length: 1mm; Width: 0.02inch; Height: 0.016inch; Depth: 0.5mm; REACH SVHC: No SVHC; Military Standard: Not; Lead Free: Lead Free; RoHS Compliant: Yes; ComponentLink1URL: https://datasheet.ciiva.com/11808/0900766b80c66297-11808422.pdf?src-supplier=RSComponents; ComponentLink1Description: https://datasheet.ciiva.com/11808/0900766b80c66297-11808422.pdf?src-supplier=RSComponents; ComponentLink2URL: https://datasheet.ciiva.com/7983/1018594-7983495.pdf?src-supplier=Element14; ComponentLink2Description: https://datasheet.ciiva.com/7983/1018594-7983495.pdf?src-supplier=Element14; ComponentLink3URL: https://datasheet.ciiva.com/2453/pyu-r-int-thick-7-2453374.pdf?src-supplier=Digi-Key; ComponentLink3Description: https://datasheet.ciiva.com/2453/pyu-r-int-thick-7-2453374.pdf?src-supplier=Digi-Key; ComponentLink4URL: https://datasheet.ciiva.com/2453/pyu-r-int-thick-7-2453375.pdf?src-supplier=Digi-Key; ComponentLink4Description: https://datasheet.ciiva.com/2453/pyu-r-int-thick-7-2453375.pdf?src-supplier=Digi-Key; ComponentLink5URL: https://datasheet.ciiva.com/2453/pyu-r-int-thick-7-2453373.pdf?src-supplier=Digi-Key; ComponentLink5Description: https://datasheet.ciiva.com/2453/pyu-r-int-thick-7-2453373.pdf?src-supplier=Digi-Key; ComponentLink6URL: https://datasheet.ciiva.com/5558/pyu-rc0402-51-rohs-l-6-r-5558110.pdf?src-supplier=Mouser; ComponentLink6Description: https://datasheet.ciiva.com/5558/pyu-rc0402-51-rohs-l-6-r-5558110.pdf?src-supplier=Mouser; ComponentLink7URL: https://datasheet.ciiva.com/7849/1018594-7849838.pdf?src-supplier=Element14; ComponentLink7Description: https://datasheet.ciiva.com/7849/1018594-7849838.pdf?src-supplier=Element14; ComponentLink8URL: https://datasheet.ciiva.com/7849/1018594-7849839.pdf?src-supplier=Element14; ComponentLink8Description: https://datasheet.ciiva.com/7849/1018594-7849839.pdf?src-supplier=Element14; ComponentLink9URL: https://datasheet.ciiva.com/16740/pyu-rc0402-51-rohs-l-6-r-16740923.pdf?src-supplier=Future+Electronics; ComponentLink9Description: https://datasheet.ciiva.com/16740/pyu-rc0402-51-rohs-l-6-r-16740923.pdf?src-supplier=Future+Electronics; ComponentLink10URL: https://datasheet.ciiva.com/15189/getdatasheetpartid-330680-15189357.pdf?src-supplier=Verical; ComponentLink10Description: https://datasheet.ciiva.com/15189/getdatasheetpartid-330680-15189357.pdf?src-supplier=Verical; Supplier 2: RSComponents; Stock 2: 10800; Pricing 2: 10000=0,00200, 50000=0,00200, 100000=0,00200, 200000=0,00200, 400000=0,00200 (GBP); Supplier 3: Digi-Key; Stock 3: 2629290; Pricing 3: 1=0,10000, 10=0,01500, 100=0,00610, 1000=0,00275, 2500=0,00239, 5000=0,00197 (USD); JLCPCB: C138054; Supplier Part Number 1: RC0402FR-07150RL; Supplier Part Number 2: 1987666; Supplier Part Number 3: 311-150LRCT-ND; Supplier: Rs; Supplier Part Number: 1987667; Stock: 19700; Pricing: 100=0,005, 1000=0,004, 2500=0,004, 5000=0,004, 10000=0,004 (EUR); Reach SVHC Compliant: Unknown
R3-R5 R7 R8 = R 5.1K 0402: SMD Chip Resistor, 5.1 kOhm, ± 1%, 63 mW, 0402 [1005 Metric], Thick Film, General Purpose CRCW04025K10FKED; Manufacturer: Vishay; Value: 5.1kR; Temperature Coefficient: 100ppm/°C; Voltage Rating: 50V; Max Power Dissipation: 63mW; Supplier: Mouser; Supplier Part Number: 71-CRCW0402-5.1K-E3; Manufacturer Part Number: CRCW04025K10FKED; RoHS: Yes; Category: Chip SMD Resistors; Stock: 412876; Pricing: 1=0,1, 10=0,017, 50=0,017, 100=0,01, 1000=0,007, 10000=0,003 (USD); Case/Package: 0402; Case Code (Metric): 1005; Case Code (Imperial): 0402; Weight: 2.3E-05oz; Contact Plating: Tin; Min Operating Temperature: -55°C; Max Operating Temperature: 155°C; Packaging: Tape and Reel; Tolerance: 1%; Number of Terminations: 2; Series: CRCW; Power Rating: 63mW; Voltage Rating (DC): 50V; Termination: SMD/SMT; Resistor Type: Thick Film; Resistance Tolerance: 1%; Features: Automotive AEC-Q200; Package Quantity: 10000; Technology: THICK FILM; Construction: Rectangular; Length: 1mm; Width: 0.5mm; Height: 0.35mm; Depth: 0.5mm; Ratings: AEC-Q200; Radiation Hardening: No; RoHS Compliant: Yes; Reach SVHC Compliant: Unknown; Lead Free: 5697LeadFree; Military Standard: Not; ComponentLink1URL: https://datasheet.ciiva.com/11809/0900766b80d98824-11809770.pdf?src-supplier=Rs; ComponentLink1Description: https://datasheet.ciiva.com/11809/0900766b80d98824-11809770.pdf?src-supplier=Rs; ComponentLink2URL: https://datasheet.ciiva.com/22675/1847332-22675086.pdf?src-supplier=Element14; ComponentLink2Description: https://datasheet.ciiva.com/22675/1847332-22675086.pdf?src-supplier=Element14; ComponentLink3URL: https://datasheet.ciiva.com/3256/dcrcwe3-3256680.pdf?src-supplier=Avnet; ComponentLink3Description: https://datasheet.ciiva.com/3256/dcrcwe3-3256680.pdf?src-supplier=Avnet; ComponentLink4URL: https://datasheet.ciiva.com/7690/1697337-7690682.pdf?src-supplier=Element14; ComponentLink4Description: https://datasheet.ciiva.com/7690/1697337-7690682.pdf?src-supplier=Element14; ComponentLink5URL: https://datasheet.ciiva.com/7172/1635184-7172981.pdf?src-supplier=Newark; ComponentLink5Description: https://datasheet.ciiva.com/7172/1635184-7172981.pdf?src-supplier=Newark; ComponentLink6URL: https://datasheet.ciiva.com/2464/dcrcwe3-2464034.pdf?src-supplier=Digikey; ComponentLink6Description: https://datasheet.ciiva.com/2464/dcrcwe3-2464034.pdf?src-supplier=Digikey; ComponentLink7URL: https://datasheet.ciiva.com/2464/dcrcwe3-2464035.pdf?src-supplier=Digikey; ComponentLink7Description: https://datasheet.ciiva.com/2464/dcrcwe3-2464035.pdf?src-supplier=Digikey; ComponentLink8URL: https://datasheet.ciiva.com/7690/1697337-7690683.pdf?src-supplier=Element14; ComponentLink8Description: https://datasheet.ciiva.com/7690/1697337-7690683.pdf?src-supplier=Element14; ComponentLink9URL: https://datasheet.ciiva.com/2464/dcrcwe3-2464033.pdf?src-supplier=Digikey; ComponentLink9Description: https://datasheet.ciiva.com/2464/dcrcwe3-2464033.pdf?src-supplier=Digikey
R6 = R 10K 0402 1%: Res Thick Film 0402 10K Ohm 1% 0.2W(1/5W) ±100ppm/°C Pad SMD Automotive T/R CRCW040210K0FKEDHP; Manufacturer: Vishay Dale; Value: 10kR; Power Rating: 125mW; Voltage Rating: 50V; Max Power Dissipation: 200mW; Supplier: Mouser; Supplier Part Number: 71-CRCW040210K0FKEDH; Manufacturer Part Number: CRCW040210K0FKEDHP; RoHS: Yes; Category: Chip SMD Resistors; Stock: 340946; Pricing: 1=0,12, 10=0,037, 50=0,037, 100=0,022, 1000=0,016, 10000=0,009 (USD); Case/Package: 0402; Case Code (Imperial): 0402; Case Code (Metric): 1005; Contact Plating: Tin; Weight: 2.3E-05oz; Min Operating Temperature: -55°C; Max Operating Temperature: 155°C; Tolerance: 1%; Packaging: Tape and Reel; Termination: SMD/SMT; Series: CRCW-HP; Resistance Tolerance: 1%; Package Quantity: 10000; Resistor Type: Thick Film; Temperature Coefficient: 100ppm/°C; Number of Terminations: 2; Voltage Rating (DC): 50V; Features: Automotive AEC-Q200; Construction: Rectangular; Technology: THICK FILM; Length: 1mm; Width: 0.5mm; Height: 0.3mm; Depth: 0.5mm; Ratings: AEC-Q200; Radiation Hardening: No; Reach SVHC Compliant: Unknown; RoHS Compliant: Yes; Lead Free: 5697LeadFree; Military Standard: Not; ComponentLink1URL: https://datasheet.ciiva.com/9052/crcwhpe3-9052616.pdf?src-supplier=Avnet; ComponentLink1Description: https://datasheet.ciiva.com/9052/crcwhpe3-9052616.pdf?src-supplier=Avnet; ComponentLink2URL: https://datasheet.ciiva.com/7725/crcwhpe3-7725759.pdf?src-supplier=Element14; ComponentLink2Description: https://datasheet.ciiva.com/7725/crcwhpe3-7725759.pdf?src-supplier=Element14; ComponentLink3URL: https://datasheet.ciiva.com/28588/1750852-28588877.pdf?src-supplier=Element14; ComponentLink3Description: https://datasheet.ciiva.com/28588/1750852-28588877.pdf?src-supplier=Element14; ComponentLink4URL: https://datasheet.ciiva.com/5550/crcwhpe3-46056-5550367.pdf?src-supplier=Mouser; ComponentLink4Description: https://datasheet.ciiva.com/5550/crcwhpe3-46056-5550367.pdf?src-supplier=Mouser
U1 = U MAX15462AATA+T: IC Reg Buck 3.3V 300MA 8TDFN; Manufacturer: Analog Devices; Supplier: Mouser; Supplier Part Number: 700-MAX15462AATA+T; Manufacturer Part Number: MAX15462AATA+T; RoHS: No; Stock: 15042; Pricing: 1=3,05, 10=2,51, 50=2,51, 100=2,25, 1000=1,62, 10000=1,47 (USD)
U2 = U IAM-20680HP: IMU (Inertial Measurement Unit), 6-Axis, Accelerometer, Gyroscope IAM-20680HP; Manufacturer: TDK; Supplier: Mouser; Supplier Part Number: 410-IAM-20680HP; Manufacturer Part Number: IAM-20680HP; RoHS: Yes; Category: Inertial Measurement Units (IMUs); Stock: 14416; Pricing: 1=16,7, 10=14,88, 50=14,2, 100=12,36, 1000=11,39, 10000=10,35 (USD); Min Operating Temperature: -40°C; Length: 3mm; Width: 3mm